# EAGLE design Pinduino-Nano-WPC-adaptor-panalized.AR (EAGLE 9.6.2)
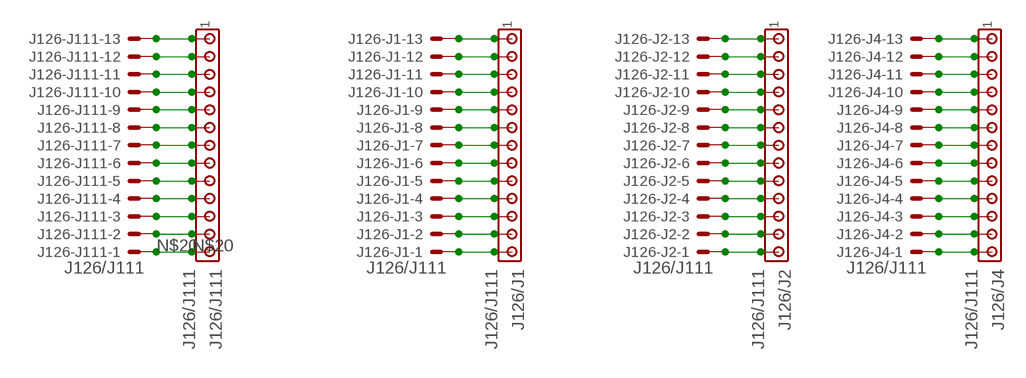
[diagram p0: schematic, sheet 1]

## Parts
J126-J1  J126/J111  KK-156-13  [KK-156-13]
J126-J2  J126/J111  KK-156-13  [KK-156-13]
J126-J4  J126/J111  KK-156-13  [KK-156-13]
J126-J111  J126/J111  KK-156-13  [KK-156-13]
J126/J1  J126/J111  MTA13-156  [1X13MTA]
J126/J2  J126/J111  MTA13-156  [1X13MTA]
J126/J4  J126/J111  MTA13-156  [1X13MTA]
J126/J111  J126/J111  MTA13-156  [1X13MTA]

## Nets
N$1: J126-J1.12 J126/J1.2
N$2: J126-J1.13 J126/J1.1
N$3: J126-J1.9 J126/J1.5
N$4: J126-J1.5 J126/J1.9
N$5: J126-J1.6 J126/J1.8
N$6: J126-J1.7 J126/J1.7
N$7: J126-J1.8 J126/J1.6
N$8: J126-J1.10 J126/J1.4
N$9: J126-J1.11 J126/J1.3
N$10: J126-J1.4 J126/J1.10
N$11: J126-J1.3 J126/J1.11
N$12: J126-J1.2 J126/J1.12
N$13: J126-J1.1 J126/J1.13
N$14: J126-J2.12 J126/J2.2
N$15: J126-J2.13 J126/J2.1
N$16: J126-J2.9 J126/J2.5
N$17: J126-J2.5 J126/J2.9
N$18: J126-J2.6 J126/J2.8
N$19: J126-J111.3 J126/J111.11
N$20: J126-J111.2 J126/J111.12
N$21: J126-J111.12 J126/J111.2
N$22: J126-J111.13 J126/J111.1
N$23: J126-J111.4 J126/J111.10
N$24: J126-J2.7 J126/J2.7
N$25: J126-J111.1 J126/J111.13
N$26: J126-J2.8 J126/J2.6
N$27: J126-J111.9 J126/J111.5
N$28: J126-J2.10 J126/J2.4
N$29: J126-J2.11 J126/J2.3
N$30: J126-J2.4 J126/J2.10
N$31: J126-J2.3 J126/J2.11
N$32: J126-J2.2 J126/J2.12
N$33: J126-J2.1 J126/J2.13
N$47: J126-J4.12 J126/J4.2
N$48: J126-J4.13 J126/J4.1
N$49: J126-J4.9 J126/J4.5
N$50: J126-J4.5 J126/J4.9
N$51: J126-J4.6 J126/J4.8
N$52: J126-J4.7 J126/J4.7
N$53: J126-J4.8 J126/J4.6
N$54: J126-J4.10 J126/J4.4
N$55: J126-J4.11 J126/J4.3
N$56: J126-J4.4 J126/J4.10
N$57: J126-J4.3 J126/J4.11
N$58: J126-J111.6 J126/J111.8
N$59: J126-J111.7 J126/J111.7
N$60: J126-J4.2 J126/J4.12
N$61: J126-J4.1 J126/J4.13
N$62: J126-J111.8 J126/J111.6
N$64: J126-J111.5 J126/J111.9
N$65: J126-J111.10 J126/J111.4
N$66: J126-J111.11 J126/J111.3

## Library data of the parts
J126-J1 J126-J2 J126-J4 J126-J111 = con-molex:KK-156-13: KK 156 HEADER Source: http://www.molex.com/pdm_docs/sd/026604100_sd.pdf; OC_FARNELL: unknown; OC_NEWARK: unknown
J126/J1 J126/J2 J126/J4 J126/J111 = con-amp:MTA13-156: AMP connector

## Net classes
0 default: width 0.406 mm
1 Power: width 0.61 mm
2 GND: width 0.61 mm

## Board
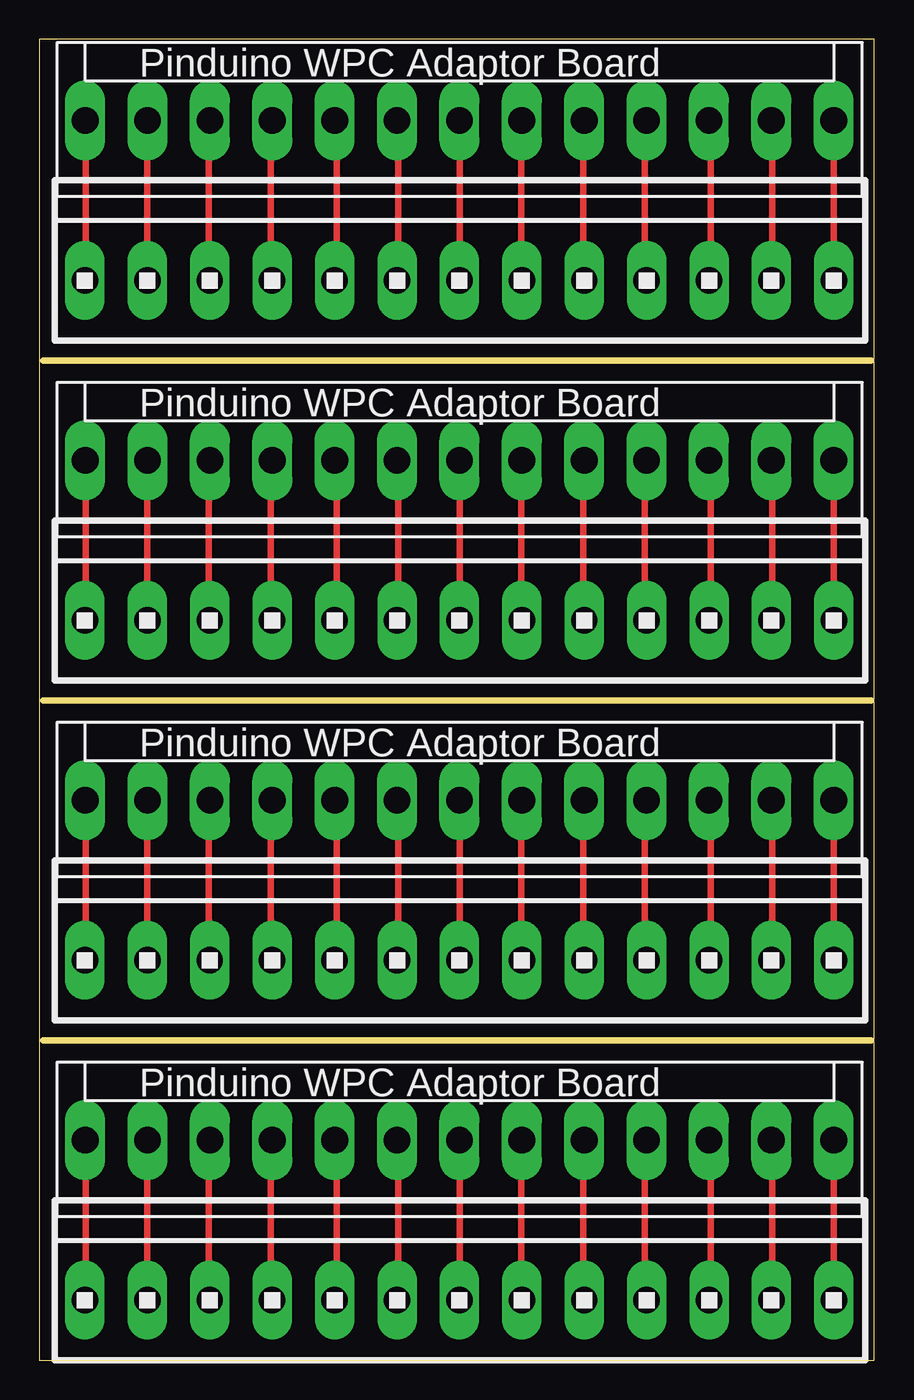
[diagram p1: board, top side]

Size 53.01 x 83.89 mm. Coordinates in mm from the lower left corner, seen from the top.
Outline: 0,0 53.01,0 53.01,83.89 0,83.89 0,0
Copper layers (1*16): Top 0.035mm / dielectric 1.5mm / Bottom 0.035mm
Design rules "SeeedStudio_2layer_DRU_no_angle_20140221": minimum track width 6mil, minimum drill 12mil, track to track 6mil, track to pad 6mil, pad to pad 6mil, via to via 6mil, smd to smd 0mil, copper to edge 10mil, drill to drill 10mil, minimum pad ring 10mil, minimum via ring 6mil, stop-mask expansion 2mil, vias tented up to drill 100mil, thermal gap 10mil
Milling: 3 lines

### Footprints (pad centres in the part's own frame; a part is rotated, then mirrored left to right if it is on the bottom)
KK-156-13 = drill 1.7 pad 2.184 long: 1 -23.76,0; 2 -19.8,0; 3 -15.84,0; 4 -11.88,0; 5 -7.92,0; 6 -3.96,0; 7 0,0; 8 3.96,0; 9 7.92,0; 10 11.88,0; 11 15.84,0; 12 19.8,0; 13 23.76,0
1X13MTA = drill 1.676 long: 1 23.774,0; 2 19.812,0; 3 15.85,0; 4 11.887,0; 5 7.925,0; 6 3.962,0; 7 0,0; 8 -3.962,0; 9 -7.925,0; 10 -11.887,0; 11 -15.85,0; 12 -19.812,0; 13 -23.774,0

### Placement (x,y rotation side)
J126-J1  26.67,35.56 0 top
J126-J2  26.67,57.15 0 top
J126-J4  26.67,78.74 0 top
J126-J111  26.67,13.97 0 top
J126/J1  26.67,25.4 0 top
J126/J2  26.67,46.99 0 top
J126/J4  26.67,68.58 0 top
J126/J111  26.67,3.81 0 top

### Tracks (layer width: path | path; a pad name or v marks a point on that pad's centre or on a via)
N$1
  Top 0.406: J126/J1.2 46.53,25.43 46.53,35.48 J126-J1.12
N$2
  Top 0.406: J126/J1.1 50.44,35.48 J126-J1.13
N$3
  Top 0.406: J126/J1.5 34.52,25.43 34.52,35.48 J126-J1.9
N$4
  Top 0.406: J126/J1.9 18.87,25.43 18.87,35.48 J126-J1.5
N$5
  Top 0.406: J126/J1.8 22.78,25.43 22.78,35.48 J126-J1.6
N$6
  Top 0.406: J126/J1.7 26.7,25.43 26.7,35.48 J126-J1.7
N$7
  Top 0.406: J126/J1.6 30.61,25.43 30.61,35.48 J126-J1.8
N$8
  Top 0.406: J126/J1.4 38.43,25.43 38.43,35.48 J126-J1.10
N$9
  Top 0.406: J126/J1.3 42.62,25.43 42.62,35.48 J126-J1.11
N$10
  Top 0.406: J126/J1.10 14.68,25.43 14.68,35.48 J126-J1.4
N$11
  Top 0.406: J126/J1.11 10.77,25.43 10.77,35.48 J126-J1.3
N$12
  Top 0.406: J126/J1.12 6.86,35.48 J126-J1.2
N$13
  Top 0.406: J126/J1.13 2.95,25.43 2.95,35.48 J126-J1.1
N$14
  Top 0.406: J126/J2.2 46.53,47.22 46.53,57 J126-J2.12
N$15
  Top 0.406: J126/J2.1 50.44,57 J126-J2.13
N$16
  Top 0.406: J126/J2.5 34.52,47.22 34.52,57 J126-J2.9
N$17
  Top 0.406: J126/J2.9 18.87,47.22 18.87,57 J126-J2.5
N$18
  Top 0.406: J126/J2.8 22.78,47.22 22.78,57 J126-J2.6
N$19
  Top 0.406: J126/J111.11 10.77,3.91 10.77,13.97 J126-J111.3
N$20
  Top 0.406: J126/J111.12 6.86,13.97 J126-J111.2
N$21
  Top 0.406: J126/J111.2 46.53,3.91 46.53,13.97 J126-J111.12
N$22
  Top 0.406: J126/J111.1 50.44,13.97 J126-J111.13
N$23
  Top 0.406: J126/J111.10 14.68,3.91 14.68,13.97 J126-J111.4
N$24
  Top 0.406: J126/J2.7 26.7,47.22 26.7,57 J126-J2.7
N$25
  Top 0.406: J126/J111.13 2.95,3.91 2.95,13.97 J126-J111.1
N$26
  Top 0.406: J126/J2.6 30.61,47.22 30.61,57 J126-J2.8
N$27
  Top 0.406: J126/J111.5 34.52,3.91 34.52,13.97 J126-J111.9
N$28
  Top 0.406: J126/J2.4 38.43,47.22 38.43,57 J126-J2.10
N$29
  Top 0.406: J126/J2.3 42.62,47.22 42.62,57 J126-J2.11
N$30
  Top 0.406: J126/J2.10 14.68,47.22 14.68,57 J126-J2.4
N$31
  Top 0.406: J126/J2.11 10.77,47.22 10.77,57 J126-J2.3
N$32
  Top 0.406: J126/J2.12 6.86,57 J126-J2.2
N$33
  Top 0.406: J126/J2.13 2.95,47.22 2.95,57 J126-J2.1
N$47
  Top 0.406: J126/J4.2 46.53,68.73 46.53,78.51 J126-J4.12
N$48
  Top 0.406: J126/J4.1 50.44,78.51 J126-J4.13
N$49
  Top 0.406: J126/J4.5 34.52,68.73 34.52,78.51 J126-J4.9
N$50
  Top 0.406: J126/J4.9 18.87,68.73 18.87,78.51 J126-J4.5
N$51
  Top 0.406: J126/J4.8 22.78,68.73 22.78,78.51 J126-J4.6
N$52
  Top 0.406: J126/J4.7 26.7,68.73 26.7,78.51 J126-J4.7
N$53
  Top 0.406: J126/J4.6 30.61,68.73 30.61,78.51 J126-J4.8
N$54
  Top 0.406: J126/J4.4 38.43,68.73 38.43,78.51 J126-J4.10
N$55
  Top 0.406: J126/J4.3 42.62,68.73 42.62,78.51 J126-J4.11
N$56
  Top 0.406: J126/J4.10 14.68,68.73 14.68,78.51 J126-J4.4
N$57
  Top 0.406: J126/J4.11 10.77,68.73 10.77,78.51 J126-J4.3
N$58
  Top 0.406: J126/J111.8 22.78,3.91 22.78,13.97 J126-J111.6
N$59
  Top 0.406: J126/J111.7 26.7,3.91 26.7,13.97 J126-J111.7
N$60
  Top 0.406: J126/J4.12 6.86,78.51 J126-J4.2
N$61
  Top 0.406: J126/J4.13 2.95,68.73 2.95,78.51 J126-J4.1
N$62
  Top 0.406: J126/J111.6 30.61,3.91 30.61,13.97 J126-J111.8
N$64
  Top 0.406: J126/J111.9 18.87,3.91 18.87,13.97 J126-J111.5
N$65
  Top 0.406: J126/J111.4 38.43,3.91 38.43,13.97 J126-J111.10
N$66
  Top 0.406: J126/J111.3 42.62,3.91 42.62,13.97 J126-J111.11

### Text on the board
tNames: Pinduino WPC Adaptor Board | Pinduino WPC Adaptor Board | Pinduino WPC Adaptor Board | Pinduino WPC Adaptor Board